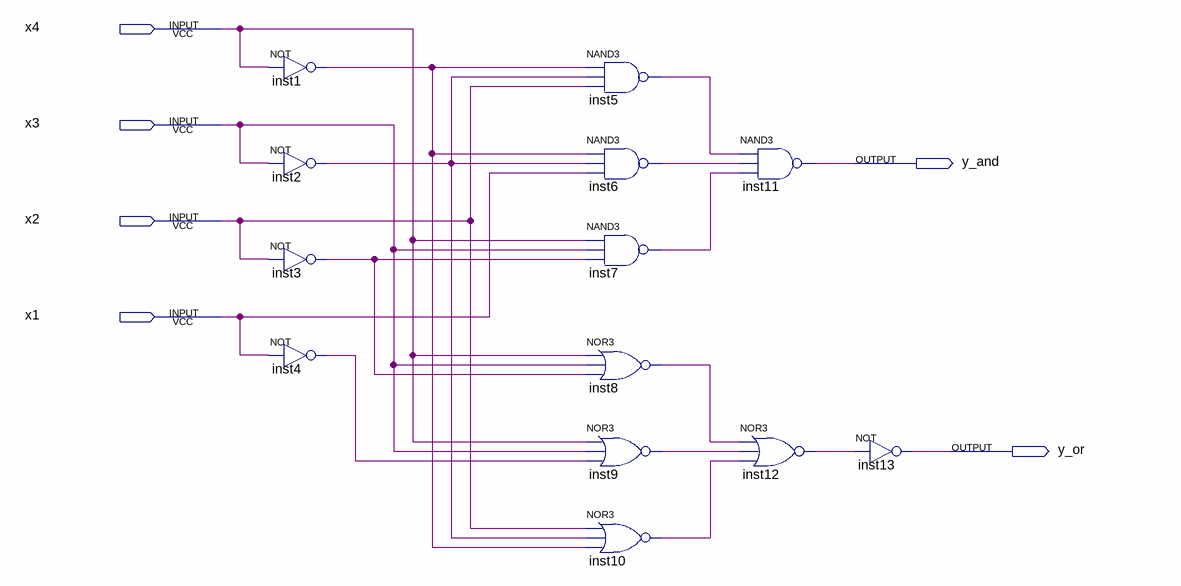
[diagram p0: schematic sheet]
// Quartus schematic lab1.bdf as structural Verilog: 13 symbols, 6 pins
module lab1 (
  input  x4,
  input  x3,
  input  x2,
  input  x1,
  output y_and,
  output y_or
);

  wire inst1_out, inst2_out, inst3_out, inst4_out, inst5_out, inst6_out, inst7_out, inst8_out, inst9_out,
       inst10_out, inst12_out;

  not inst1 (inst1_out, x4);
  not inst2 (inst2_out, x3);
  not inst3 (inst3_out, x2);
  not inst4 (inst4_out, x1);
  nand inst5 (inst5_out, inst1_out, inst2_out, x2);
  nand inst6 (inst6_out, inst1_out, inst2_out, x1);
  nand inst7 (inst7_out, x4, x3, inst3_out);
  nor inst8 (inst8_out, x4, x3, inst3_out);
  nor inst9 (inst9_out, x4, x3, inst4_out);
  nor inst10 (inst10_out, x2, inst2_out, inst1_out);
  nand inst11 (y_and, inst5_out, inst6_out, inst7_out);
  nor inst12 (inst12_out, inst8_out, inst9_out, inst10_out);
  not inst13 (y_or, inst12_out);
endmodule
